# EAGLE design RFID_revb (EAGLE 7.7.0)

## Sheet 1 of 2
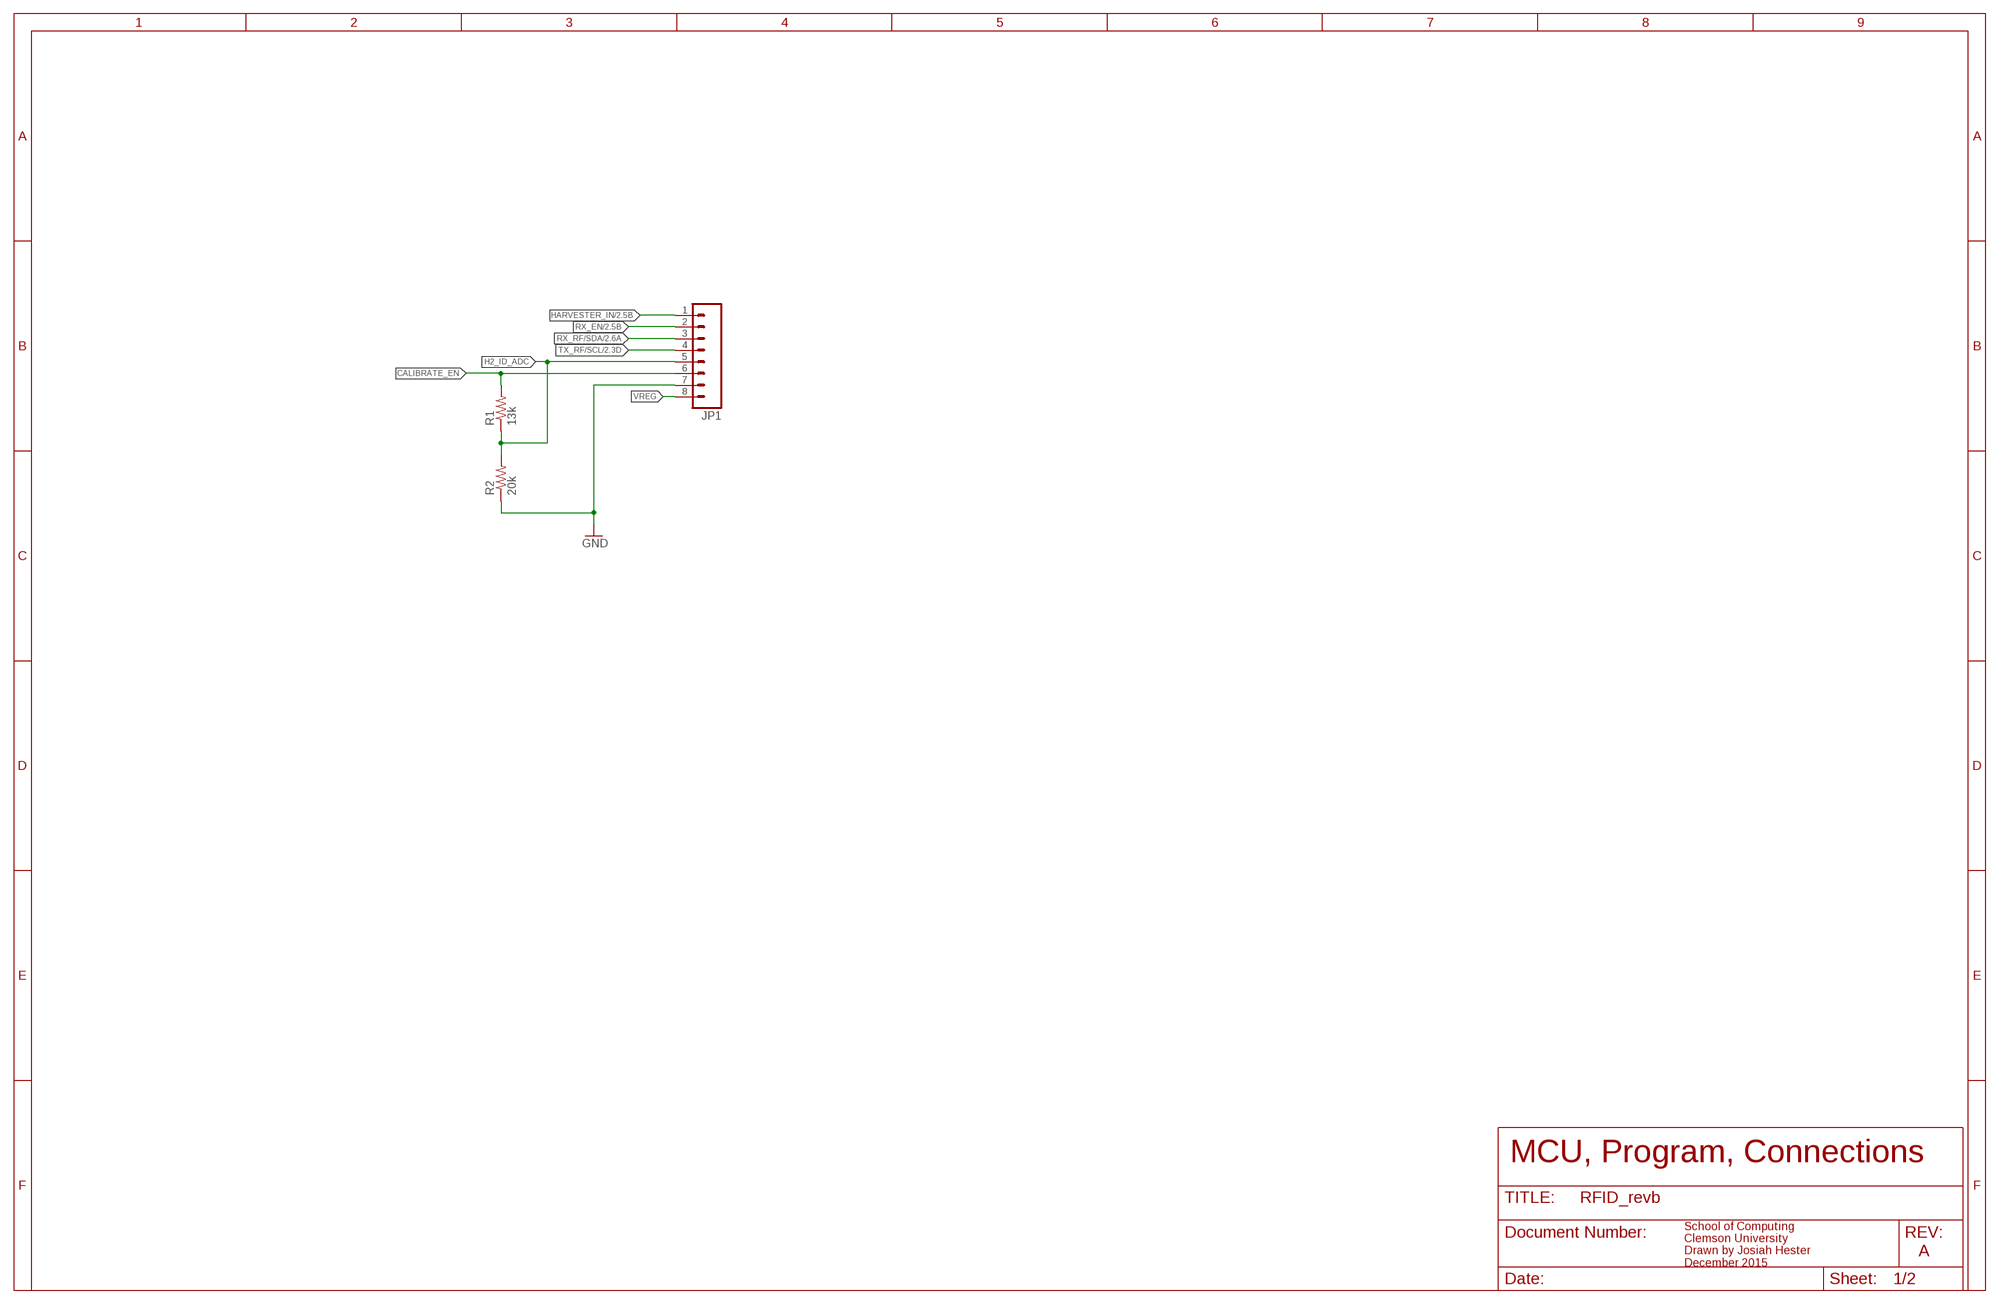
[diagram p0: schematic, sheet 1]

### Parts
JP1  M081.27MM  [1X08-1.27MM]
R1  13k  R-EU0603  [0603]
R2  20k  R-EU0603  [0603]

### Nets
CALIBRATE_EN: JP1.6 R1.2
GND: JP1.7 R2.1 ; also sheet 2
H2_ID_ADC: JP1.5 R1.1 R2.2
HARVESTER_IN: JP1.1 ; also sheet 2
RX_EN: JP1.2 ; also sheet 2
RX_RF/SDA: JP1.3 ; also sheet 2
TX_RF/SCL: JP1.4 ; also sheet 2
VREG: JP1.8 ; also sheet 2

### Notes on the sheet
- MCU, Program, Connections
- A
- School of Computing
  Clemson University
  Drawn by Josiah Hester
  December 2015

## Sheet 2 of 2
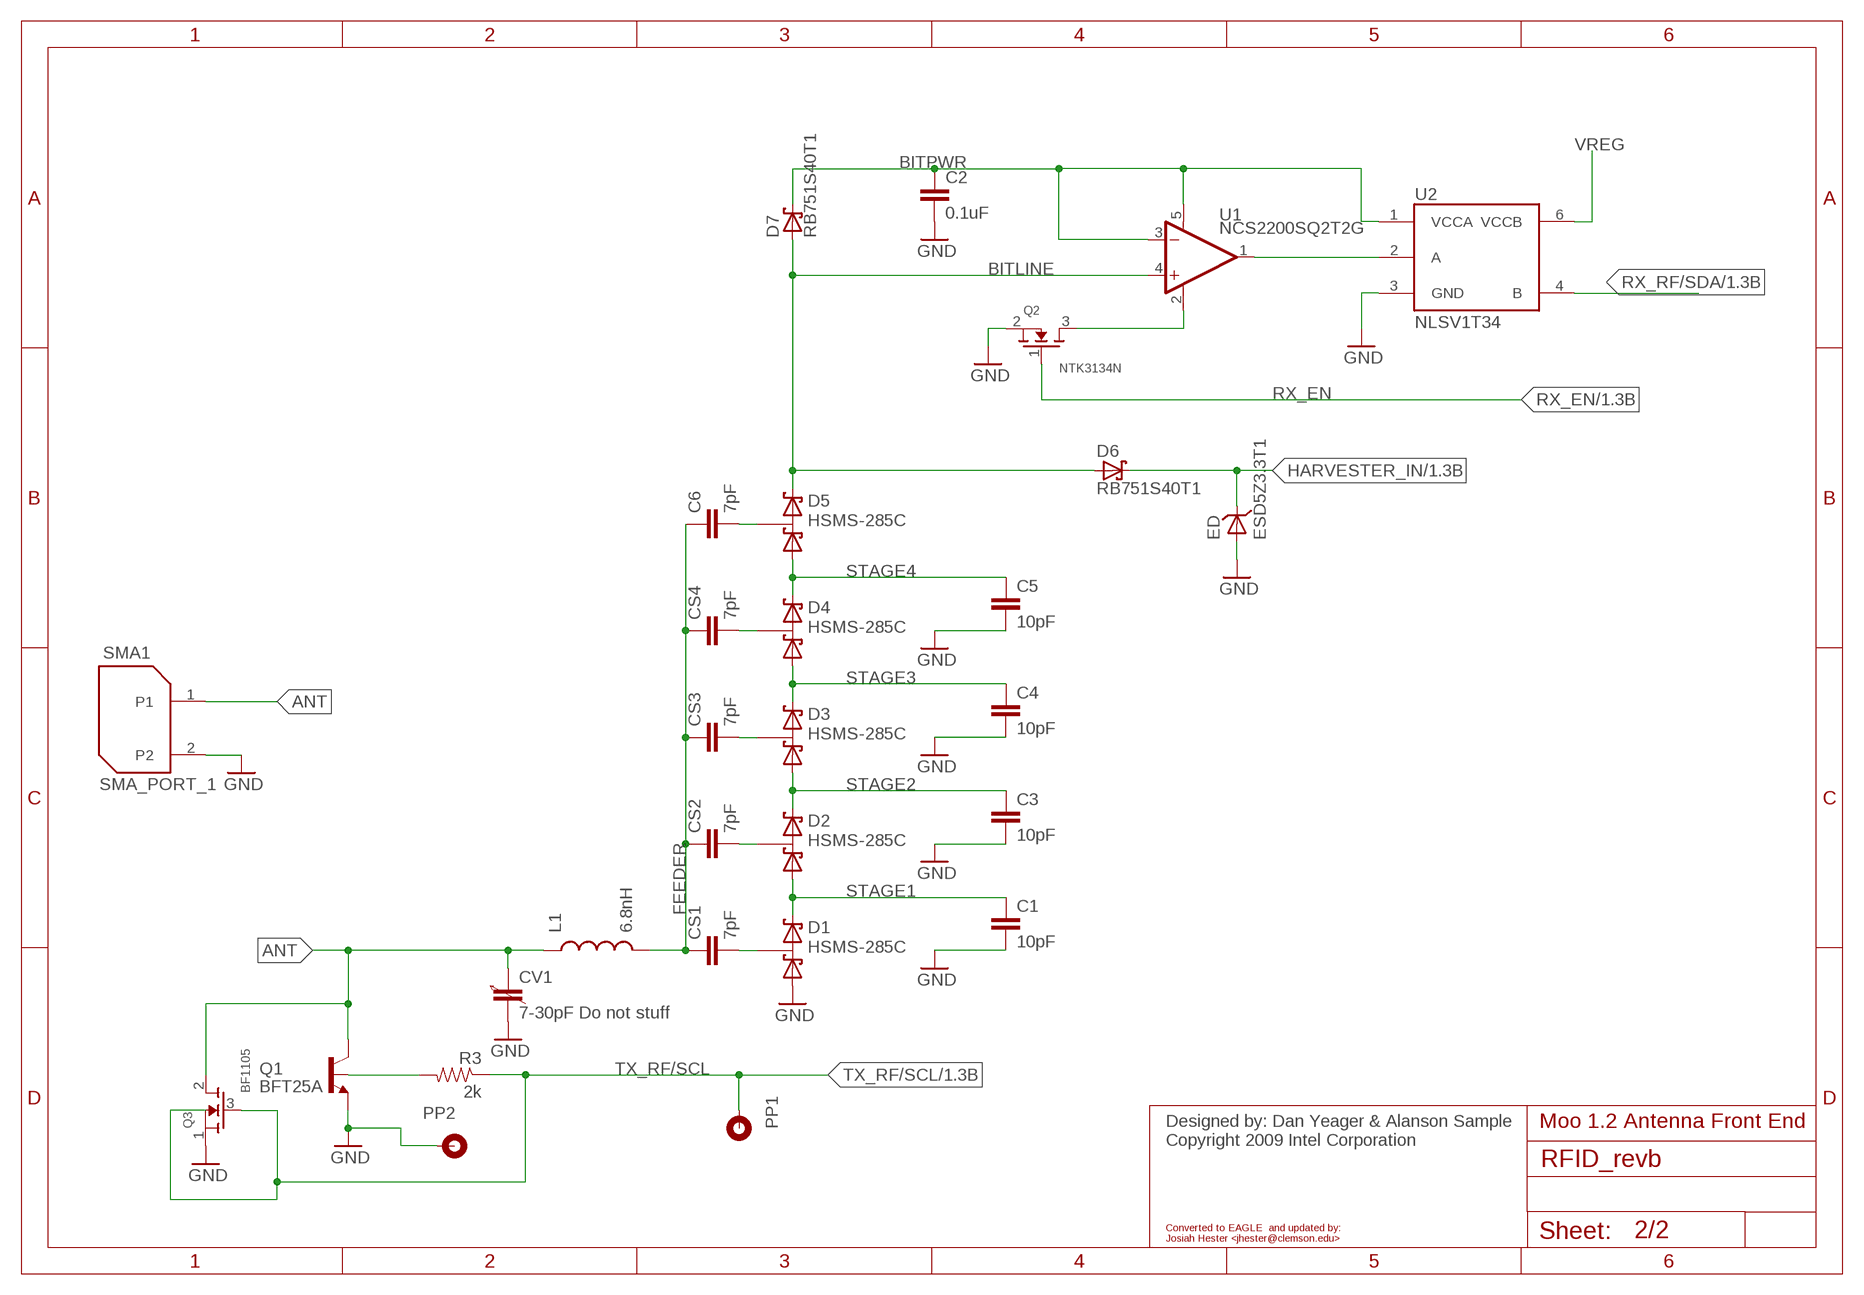
[diagram p1: schematic, sheet 2]

### Parts
C1  10pF  C-EU  [0402]
C2  0.1uF  C-EU  [0402]
C3  10pF  C-EU  [0402]
C4  10pF  C-EU  [0402]
C5  10pF  C-EU  [0402]
C6  7pF  C-EU  [0402]
CS1  7pF  C-EU  [0402]
CS2  7pF  C-EU  [0402]
CS3  7pF  C-EU  [0402]
CS4  7pF  C-EU  [0402]
CV1  7-30pF Do not stuff  VAR-CAP_603_1  [VAR-CAP_603_1PRIMARY]
D1  HSMS-285C  [SOT-323,_HSMS-285C_1PRIMARY]
D2  HSMS-285C  [SOT-323,_HSMS-285C_1PRIMARY]
D3  HSMS-285C  [SOT-323,_HSMS-285C_1PRIMARY]
D4  HSMS-285C  [SOT-323,_HSMS-285C_1PRIMARY]
D5  HSMS-285C  [SOT-323,_HSMS-285C_1PRIMARY]
D6  RB751S40T1  [SOD-523_1PRIMARY]
D7  RB751S40T1  [SOD-523_1PRIMARY]
ED  ESD5Z3.3T1  [SOD-523_1PRIMARY]
L1  6.8nH  0603_1  [0603_1PRIMARY]
PP1  PROBE_POINT_2  [PROBE_POINT_2PRIMARY]
PP2  PROBE_POINT_1  [PROBE_POINT_2PRIMARY]
Q1  BFT25A  [SOT-23_1PRIMARY]
Q2  NTK3134N  [SOT723_1PRIMARY]
Q3  BF1105  [SOT-143R]
R3  2k  R-EU  [0402]
SMA1  SMA_PORT_1  [SMA_PORT_1PRIMARY]
U1  NCS2200SQ2T2G  [SC70-5_1PRIMARY]
U2  NLSV1T34  [ULLGA6]

### Nets
ANT: CV1.1 L1.1 Q1.3(C) Q3.2(D) SMA1.1
BITLINE: D5.2 D6.2(A) D7.2(A) U1.4
BITPWR: C2.1 D7.1(C) U1.3 U1.5 U2.1(VCCA)
CONTROL: Q1.1(B) R3.2
FEEDER: C6.1 CS1.1 CS2.1 CS3.1 CS4.1 L1.2
GND: C1.2 C2.2 C3.2 C4.2 C5.2 CV1.2 D1.1 ED.2 PP2.1 Q1.2(E) Q2.2 Q3.1(S) SMA1.2 U2.3(GND) ; also sheet 1
HARVESTER_IN: D6.1(C) ED.1 ; also sheet 1
N$1: U1.1 U2.2(A)
N$2: Q2.3 U1.2
NETCS1_2: CS1.2 D1.3
NETCS2_2: CS2.2 D2.3
NETCS3_2: CS3.2 D3.3
NETCS4_2: CS4.2 D4.3
NETCS5_2: C6.2 D5.3
RX_EN: Q2.1 ; also sheet 1
RX_RF/SDA: U2.4(B) ; also sheet 1
STAGE1: C1.1 D1.2 D2.1
STAGE2: C3.1 D2.2 D3.1
STAGE3: C4.1 D3.2 D4.1
STAGE4: C5.1 D4.2 D5.1
TX_RF/SCL: PP1.1 Q3.3(G) Q3.4(G2) R3.1 ; also sheet 1
VREG: U2.6(VCCB) ; also sheet 1

### Notes on the sheet
- Moo 1.2 Antenna Front End
- Designed by: Dan Yeager & Alanson Sample
  Copyright 2009 Intel Corporation
- Converted to EAGLE  and updated by:
  Josiah Hester <jhester@clemson.edu>

## Library data of the parts
C1 C3-C5 = tiny_passives:C-EU; MPN: GRM1555C1H100JA01D
C2 = tiny_passives:C-EU; MPN: 0402YD104KAT2A
C6 CS4 = tiny_passives:C-EU; MPN: GRM1555C1H7R0DA01D
CS1-CS3 = tiny_passives:C-EU; DIGIKEY: 490-5878-1-ND; MPN: GRM1555C1H7R0DA01D
CV1 = Moo1.2:VAR-CAP_603_1; MPN: TZY2R250AC01R00
D1-D5 = Moo1.2:HSMS-285C; MPN: HSMS-285C-BLKG
D6 D7 = Moo1.2:RB751S40T1; MPN: RB751S40T1G
ED = Moo1.2:ESD5Z3.3T1; MPN: ESD5Z3.3T1G
JP1 = SparkFun-Connectors:M08: Header 8 Standard 8-pin 0.1" header. Use with straight break away headers (SKU : PRT-00116), right angle break away headers (PRT-00553), swiss pins (PRT-00743), machine pins (PRT-00117), and female headers (PRT-00115).; MPN: GRPB081VWVN-RC
L1 = Moo1.2:0603_1; MPN: MLG1608B6N8DT000
PP1 = Moo1.2:PROBE_POINT_2
PP2 = Moo1.2:PROBE_POINT_1
Q1 = Moo1.2:BFT25A; DIGIKEY: 568-1992-1-ND; MPN: BFT25A,215
Q2 = Moo1.2:NTK3134N; MPN: NTK3134NT1G
Q3 = bf1105:BF1105; MPN: BF1105R,215
R1 = tiny_passives:R-EU; MPN: RC0603FR-0713KL
R2 = tiny_passives:R-EU; MPN: CRCW060320K0FKEA
R3 = tiny_passives:R-EU; MPN: CRCW04022K00FKED
SMA1 = Moo1.2:SMA_PORT_1
U1 = Moo1.2:NCS2200SQ2T2G; DIGIKEY: NCS2200SQ2T2GOSCT-ND; MPN: NCS2200SQ2T2G
U2 = nlsv1t34:NLSV1T34: ON Semi: NLSV1T34 1-Bit Dual-Supply Non-Inverting Level Translator The NLSV1T34 is a 1−bit configurable dual−supply voltage level translator. The input An and output Bn ports are designed to track two different power supply rails, VCCA and VCCB respectively. Both supply rails are configurable from 0.9 V to 4.5 V allowing universal low−voltage translation from the input An to the output Bn port.; MPN: NLSV1T34AMX1TCG

## Board
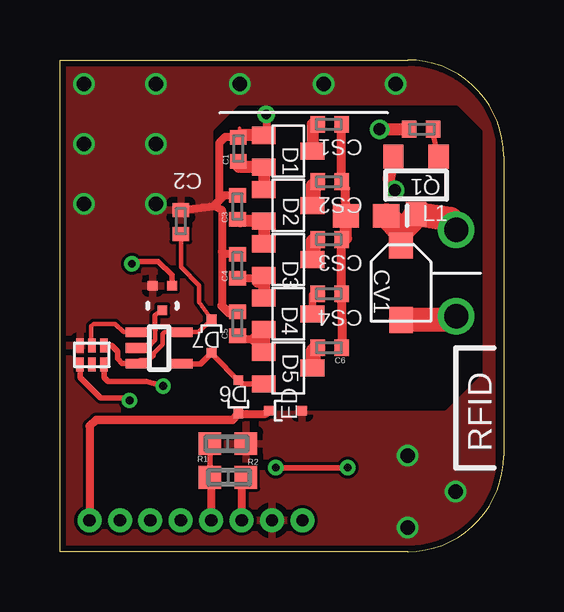
[diagram p2: board, top side]
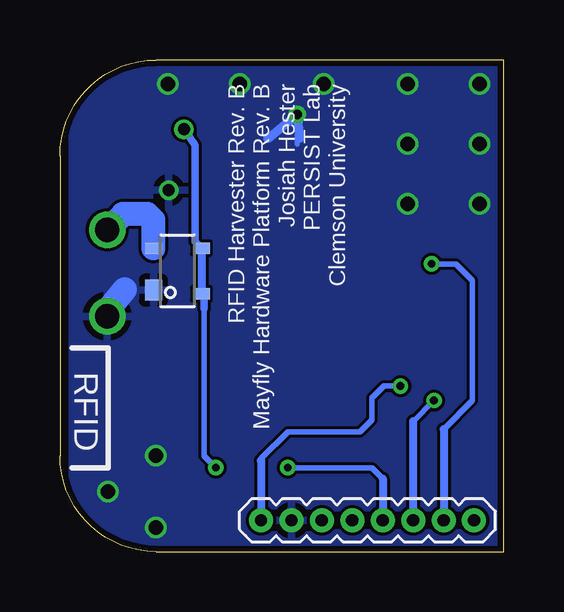
[diagram p3: board, bottom side, seen from below]

Size 18.5 x 20.5 mm. Coordinates in mm from the lower left corner, seen from the top.
Outline: 14.5,0 0,0 0,20.5 14.5,20.5 arc-90 18.5,16.5 18.5,4 arc-90 14.5,0
Copper layers (1*16): Top 0.035mm / dielectric 1.5mm / Bottom 0.035mm
Design rules "MF_Standard_2_Layer": minimum track width 5mil, minimum drill 12mil, track to track 5mil, track to pad 5mil, pad to pad 5mil, via to via 5mil, smd to smd 0mil, copper to edge 10mil, drill to drill 10mil, minimum pad ring 6mil, minimum via ring 6mil, stop-mask expansion 2mil, vias tented up to drill 25mil, thermal gap 10mil

### Footprints (pad centres in the part's own frame; a part is rotated, then mirrored left to right if it is on the bottom)
0402 = smd 0.6 x 0.7: 1 -0.5,0; 2 0.5,0
VAR-CAP_603_1PRIMARY = smd 1.092 x 0.991: 1 -1.548,0; 2 1.55,0.01
SOT-323,_HSMS-285C_1PRIMARY = smd 0.711 x 0.991: 1 -0.66,-1.016; 2 0.66,-1.016; 3 0,1.016
SOD-523_1PRIMARY = smd 0.406 x 0.406: 1 0,0; 2 0,-1.397
1X08-1.27MM = drill 0.508 pad 1: 1 0,0; 2 1.27,0; 3 2.54,0; 4 3.81,0; 5 5.08,0; 6 6.35,0; 7 7.62,0; 8 8.89,0
0603_1PRIMARY = smd 1.092 x 0.991: 1 -0.838,0; 2 0.838,0
PROBE_POINT_2PRIMARY = drill 0.508 pad 0.762: 1 0,0
SOT-23_1PRIMARY = smd 0.838 x 0.991: 1 -0.94,-1.194; 2 0.94,-1.194; 3 0,1.194
SOT723_1PRIMARY = smd 0.406 x 0.406: 1 -0.508,0.406; 2 -0.508,-0.406; 3 0.508,0
SOT-143R = smd 0.88 x 0.7: 1 0.8,-1 | smd 0.48 x 0.7: 2 -0.95,-1; 3 -0.95,1; 4 0.95,1
0603 = smd 0.95 x 0.95: 1 -0.75,0; 2 0.75,0
SMA_PORT_1PRIMARY = drill 1.016 pad 1.397: 1 0,1.803; 2 0,-1.803
SC70-5_1PRIMARY = smd 0.406 x 0.914: 1 -0.66,-0.94; 2 0,-0.94; 3 0.66,-0.94; 4 0.66,0.94; 5 -0.66,0.94
ULLGA6 = smd 0.3 x 0.58: 1 -0.5,-0.395; 2 0,-0.395; 3 0.5,-0.395; 4 0.5,0.395; 5 0,0.395; 6 -0.5,0.395

### Placement (x,y rotation side)
C1  7.44,16.77 90 top
C2  5.04,13.74 90 top
C3  7.4,14.35 90 top
C4  7.4,11.9 90 top
C5  7.4,9.5 90 top
C6  11.25,8.5 180 top
CS1  11.25,17.81 180 top
CS2  11.25,15.42 180 top
CS3  11.25,13.01 180 top
CS4  11.25,10.75 180 top
CV1  14.22,11.21 270 top
D1  9.52,16.69 270 top
D2  9.52,14.43 270 top
D3  9.52,12.17 270 top
D4  9.52,9.91 270 top
D5  9.52,7.65 270 top
D6  7.44,5.75 180 top
D7  6.32,9.69 0 top
ED  8.71,5.87 90 top
JP1  1.23,1.3 180 bottom
L1  12.77,14 180 top
PP1  13.33,17.61 270 top
PP2  13.96,15.07 180 top
Q1  14.85,15.27 180 top
Q2  4.27,10.57 270 top
Q3  13.6,11.7 270 bottom
R1  7,3.1 0 top
R2  7,4.5 180 top
R3  15.06,17.61 0 top
SMA1  16.53,11.61 0 top
U1  4.13,8.49 270 top
U2  1.33,8.2 180 top

### Tracks (layer width: path | path; a pad name or v marks a point on that pad's centre or on a via)
ANT
  Top 1.016: SMA1.1 16.27,13.88 Q1.3 14.65,13.77 14.22,13.34 | CV1.1 14.22,13.34 | 14.22,13.34 L1.1
  Bottom 1: Q3.2 14.6,13.82 Q1.3 15.87,14.08 SMA1.1
BITLINE
  Top 0.152: 8.45,6.97 8.48,6.94
  Top 0.222: U1.4 5.86,7.83 D7.2 6.42,8.16 D6.2 7.59,6.99 8.3,6.99
  Top 0.254: 8.45,6.99 8.3,6.99
  Top 0.305: D5.2 8.45,6.97 | 8.48,6.94 8.35,6.81 | 8.63,6.99 D5.2 | D5.2 8.45,6.99
BITPWR
  Top 0.178: U1.3 3.34,7.98 3.7,7.98 3.88,8.16 3.9,8.16 3.9,8.26 4.28,8.64 4.28,9.07 4.36,9.15 U1.5 5.78,9.15 D7.1 5.8,10.41 5.8,11.1 5.04,11.86 C2.1
  Top 0.203: D7.1 6.42,9.63
  Top 0.222: U2.1 2.15,8.6 2.4,8.35 2.4,8.05 2.6,7.85 3.17,7.85 U1.3
CALIBRATE_EN
  Top 0.222: 7.58,2.93 R1.2
  Top 0.333: 7.58,2.93 JP1.6
CONTROL
  Top 0.203: Q1.1 15.59,17.28 R3.2
FEEDER
  Top 0.152: 11.91,13.06 CS3.1
  Top 0.381: CS3.1 CS4.1 11.76,8.66 C6.1 | L1.2 11.91,15.12 CS2.1 CS1.1
  Top 0.508: 11.91,13.06 11.93,13.06 L1.2
GND  (via drill 0.41 pad 0.61, 0.6)
  Top 0.152: 7.49,17.66 7.49,17.56 7.69,17.36 | D1.1 8.5,17.33
  Top 0.33: v8.6,18.23 8.6,17.6 8.5,17.5 | C2.2 6.4,14.4 | 6.4,14.4 6.65,14.65 | 6.65,14.65 6.65,17.05 6.9,17.3 7.41,17.3 C1.2 | C3.2 6.85,14.85 6.65,14.65 | 6.4,14.4 6.5,14.4 6.75,14.25 6.75,12.5 | C4.2 6.85,12.4 6.75,12.5 | 6.75,12.5 6.75,10.25 | 7.35,9.95 C5.2
  Top 0.381: 7.35,9.95 7.05,9.95 6.75,10.25 | 8.5,17.33 8.5,17.5
  Top 0.508: 8.55,17.36 D1.1 7.69,17.36 7.51,17.36 | Q1.2 13.71,15.59 arc45 13.9,15.14 PP2.1
  Top 1.016: CV1.2 16.07,9.67 SMA1.2
  Bottom 0.203: SMA1.2 arc-45 16.73,9.81 16.63,9.91 | v8.6,18.23 8.6,16.97
  Bottom 0.381: 9.82,17.23 v8.6,18.23 8.5,17.23
  Bottom 1.016: 15.79,10.93 16.63,9.91 16.73,9.79
  other vias: 4,14.5 1,14.5 1,17 1,19.5 4,19.5 4,17 14.5,1 16.5,2.5 14.5,4 14,19.5 11,19.5 7.5,19.5
  pour Top: -0.5,-0.5 18,-0.5 18,20.5 0,20.5
  pour Bottom: -0.5,-0.5 18,-0.5 18,20.5 -0.5,20.5
H2_ID_ADC
  Top 0.222: 6.31,3.04 R1.1 R2.2
  Top 0.333: 6.31,3.04 JP1.5
HARVESTER_IN
  Top 0.33: D6.1 8.58,5.75 ED.1
  Top 0.333: 1.23,5.23 JP1.1
  Top 0.35: 1.23,5.23 1.5,5.5 7.19,5.5 D6.1
N$1
  Top 0.18: U1.1 2.65,9.15 2.3,9.5 1.4,9.5 1.3,9.4 1.3,8.72 U2.2
N$2
  Top 0.178: 3.65,8.49 3.98,8.82 3.98,9.22
  Top 0.203: U1.2 3.65,8.49 | 3.98,9.22 3.96,9.71 3.96,9.86 Q2.3
N$4
  cutout Top: 6.5,7.5 8,6 16,6 17.5,7.5 17.5,17.5 16.5,18.5 7.5,18.5 6.5,17.5
NETCS1_2
  Top 0.152: 10.61,16.77 D1.3
  Top 0.508: CS1.2 10.54,17.81 D1.3
NETCS2_2
  Top 0.152: 10.56,15.25 CS2.2 | 10.59,14.51 10.59,14.48 D2.3
  Top 0.635: 10.56,15.25 10.56,14.54 10.59,14.51
NETCS3_2
  Top 0.152: 10.61,12.25 D3.3 | 10.56,12.94 CS3.2
  Top 0.635: 10.61,12.25 10.56,12.3 10.56,12.94
NETCS4_2
  Top 0.305: D4.3 10.54,10.7 CS4.2
NETCS5_2
  Top 0.152: 10.56,7.68 D5.3
  Top 0.381: 10.59,8.39 10.64,8.39 C6.2
  Top 0.635: 10.59,8.39 10.56,8.36 10.56,7.68
RX_EN  (via drill 0.33)
  Top 0.222: Q2.1 4.67,11.53 4.1,12.1 3.1,12.1 v3,12
  Bottom 0.222: 2.5,5.1 1.3,6.3 1.3,11.3 2,12 v3,12
  Bottom 0.333: 2.5,5.1 JP1.2
RX_RF/SDA  (via drill 0.33)
  Top 0.222: v2.9,6.3 2.8,6.4 1.7,6.4 0.83,7.26 U2.4
  Bottom 0.222: v2.9,6.3 3.77,5.43
  Bottom 0.333: JP1.3 3.77,5.43
STAGE1
  Top 0.33: C1.1 7.44,16.14 7.55,16.03
  Top 0.508: 7.46,16.03 7.55,16.03 D1.2 D2.1
STAGE2
  Top 0.381: 7.51,13.77 7.48,13.77 C3.1
  Top 0.508: 7.51,13.77 D2.2 D3.1
STAGE3
  Top 0.33: C4.1 8.39,11.4 D3.2
  Top 0.508: 8.25,11.26 D3.2 D4.1
STAGE4
  Top 0.33: 8.1,8.85 7.55,8.85 C5.1
  Top 0.508: 8.1,8.85 D4.2 D5.1
TX_RF/SCL  (via drill 0.33)
  Top 0.222: v9,3.5 v12,3.5
  Top 0.508: PP1.1 R3.1
  Bottom 0.222: 5.04,3.04 5.5,3.5 v9,3.5 | 12.5,10.14 12.5,4 v12,3.5
  Bottom 0.305: PP1.1 12.87,16.95 12.87,12.92 Q3.3 | 12.5,10.14 12.5,10.65 Q3.4
  Bottom 0.33: Q3.3 Q3.4
  Bottom 0.333: 5.04,3.04 JP1.4
VREG  (via drill 0.33)
  Top 0.222: v4.3,6.9 3.6,7.1 2,7.1 1.83,7.26 U2.6
  Bottom 0.222: 10.1,3.82 10.1,3.9 9,5 6,5 5.5,5.5 5.5,6.4 5,6.9 v4.3,6.9
  Bottom 0.333: 10.1,3.82 10.12,3.8 JP1.8

### Text on the board
tPlace: RFID
bPlace: RFID Harvester Rev. B / Mayfly Hardware Platform Rev. B / Josiah Hester / PERSIST Lab / Clemson University | RFID